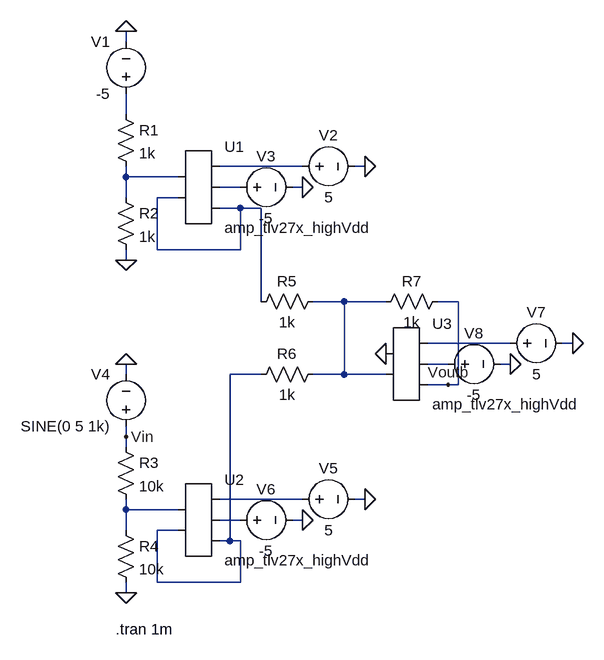
[diagram p0: schematic Lab6_3.asc]
Lab6_3.asc, the LTspice schematic file:
Version 4
SHEET 1 880 680
WIRE -192 -304 -192 -320
WIRE -192 -192 -192 -224
WIRE 80 -112 -48 -112
WIRE 176 -112 160 -112
WIRE -192 -96 -192 -112
WIRE -112 -96 -192 -96
WIRE -16 -80 -48 -80
WIRE 80 -80 64 -80
WIRE -192 -64 -192 -96
WIRE -112 -64 -144 -64
WIRE -16 -48 -48 -48
WIRE 16 -48 -16 -48
WIRE -144 16 -144 -64
WIRE -16 16 -16 -48
WIRE -16 16 -144 16
WIRE -192 32 -192 16
WIRE 16 96 16 -48
WIRE 144 96 96 96
WIRE 208 96 144 96
WIRE 320 96 288 96
WIRE 400 160 272 160
WIRE 496 160 480 160
WIRE 304 192 272 192
WIRE 400 192 384 192
WIRE -192 208 -192 192
WIRE 16 208 -32 208
WIRE 144 208 144 96
WIRE 144 208 96 208
WIRE 208 208 144 208
WIRE 304 224 272 224
WIRE 320 224 320 96
WIRE 320 224 304 224
WIRE -192 304 -192 288
WIRE -192 320 -192 304
WIRE 80 400 -48 400
WIRE 176 400 160 400
WIRE -192 416 -192 400
WIRE -112 416 -192 416
WIRE -16 432 -48 432
WIRE 80 432 64 432
WIRE -192 448 -192 416
WIRE -112 448 -144 448
WIRE -32 464 -32 208
WIRE -32 464 -48 464
WIRE -16 464 -32 464
WIRE -144 528 -144 448
WIRE -16 528 -16 464
WIRE -16 528 -144 528
WIRE -192 544 -192 528
FLAG 176 -112 0
FLAG -192 -320 0
FLAG 80 -80 0
FLAG -192 32 0
FLAG 176 400 0
FLAG -192 192 0
FLAG 80 432 0
FLAG -192 544 0
FLAG 496 160 0
FLAG 400 192 0
FLAG 208 176 0
FLAG 304 224 Voutb
FLAG -192 304 Vin
SYMBOL voltage -192 -208 R180
WINDOW 0 24 96 Left 2
WINDOW 3 24 16 Left 2
SYMATTR InstName V1
SYMATTR Value -5
SYMBOL voltage 64 -112 R270
WINDOW 0 32 56 VTop 2
WINDOW 3 -32 56 VBottom 2
SYMATTR InstName V2
SYMATTR Value 5
SYMBOL voltage -32 -80 R270
WINDOW 0 32 56 VTop 2
WINDOW 3 -32 56 VBottom 2
SYMATTR InstName V3
SYMATTR Value -5
SYMBOL res -208 -208 R0
SYMATTR InstName R1
SYMATTR Value 1k
SYMBOL res -208 -80 R0
SYMATTR InstName R2
SYMATTR Value 1k
SYMBOL AutoGenerated\\amp_tlv27x_highVdd -80 -80 R0
SYMATTR InstName U1
SYMBOL voltage -192 304 R180
WINDOW 0 24 96 Left 2
WINDOW 3 24 16 Left 2
WINDOW 123 0 0 Left 0
WINDOW 39 0 0 Left 0
SYMATTR InstName V4
SYMATTR Value SINE(0 5 1k)
SYMBOL voltage 64 400 R270
WINDOW 0 32 56 VTop 2
WINDOW 3 -32 56 VBottom 2
SYMATTR InstName V5
SYMATTR Value 5
SYMBOL voltage -32 432 R270
WINDOW 0 32 56 VTop 2
WINDOW 3 -32 56 VBottom 2
SYMATTR InstName V6
SYMATTR Value -5
SYMBOL res -208 304 R0
SYMATTR InstName R3
SYMATTR Value 10k
SYMBOL res -208 432 R0
SYMATTR InstName R4
SYMATTR Value 10k
SYMBOL AutoGenerated\\amp_tlv27x_highVdd -80 432 R0
SYMATTR InstName U2
SYMBOL res 112 80 R90
WINDOW 0 0 56 VBottom 2
WINDOW 3 32 56 VTop 2
SYMATTR InstName R5
SYMATTR Value 1k
SYMBOL res 112 192 R90
WINDOW 0 0 56 VBottom 2
WINDOW 3 32 56 VTop 2
SYMATTR InstName R6
SYMATTR Value 1k
SYMBOL res 304 80 R90
WINDOW 0 0 56 VBottom 2
WINDOW 3 32 56 VTop 2
SYMATTR InstName R7
SYMATTR Value 1k
SYMBOL voltage 384 160 R270
WINDOW 0 32 56 VTop 2
WINDOW 3 -32 56 VBottom 2
SYMATTR InstName V7
SYMATTR Value 5
SYMBOL voltage 288 192 R270
WINDOW 0 32 56 VTop 2
WINDOW 3 -32 56 VBottom 2
SYMATTR InstName V8
SYMATTR Value -5
SYMBOL AutoGenerated\\amp_tlv27x_highVdd 240 192 R0
SYMATTR InstName U3
TEXT -208 600 Left 2 !.tran 1m

The netlist it stands for:
* Lab6_3.asc
V1 N001 0 -5
V2 N002 0 5
V3 N004 0 -5
R1 N001 N003 1k
R2 N003 0 1k
* U1: amp_tlv27x_highVdd (symbol AutoGenerated\amp_tlv27x_highVdd not available, pins judged from their places): pin1=N003 pin2=N005 pin3=N002 pin4=N004 pin5=N005
V4 Vin 0 SINE(0 5 1k)
V5 N010 0 5
V6 N012 0 -5
R3 Vin N011 10k
R4 N011 0 10k
* U2: amp_tlv27x_highVdd (symbol AutoGenerated\amp_tlv27x_highVdd not available, pins judged from their places): pin1=N011 pin2=N009 pin3=N010 pin4=N012 pin5=N009
R5 N006 N005 1k
R6 N006 N009 1k
R7 Voutb N006 1k
V7 N007 0 5
V8 N008 0 -5
* U3: amp_tlv27x_highVdd (symbol AutoGenerated\amp_tlv27x_highVdd not available, pins judged from their places): pin1=0 pin2=N006 pin3=N007 pin4=N008 pin5=Voutb
.tran 1m
.backanno
.end